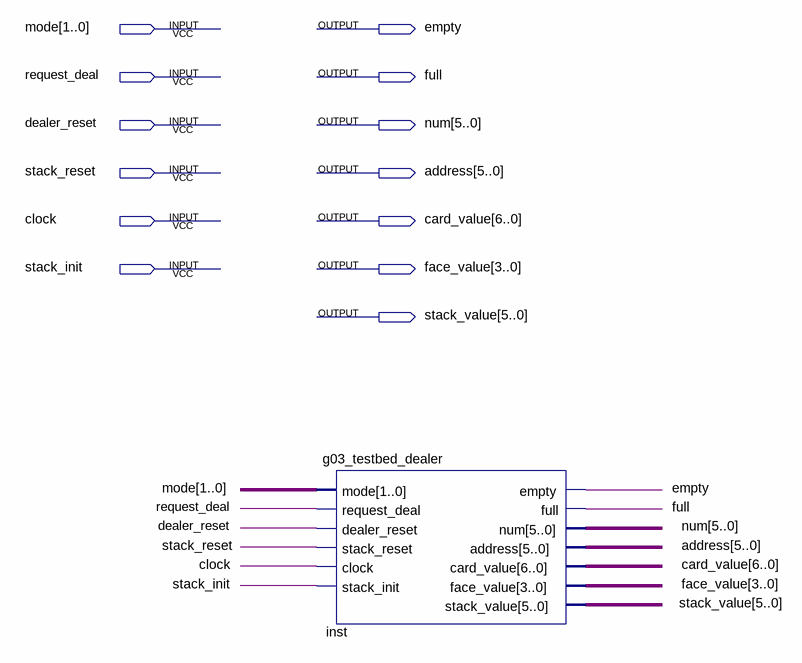
[diagram p0: schematic sheet]
// Quartus schematic g03_lab4.bdf as structural Verilog: 1 symbols, 13 pins
module g03_lab4 (
  input  [1:0] mode,
  input  request_deal,
  input  dealer_reset,
  input  stack_reset,
  input  clock,
  input  stack_init,
  output empty,
  output full,
  output [5:0] num,
  output [5:0] address,
  output [6:0] card_value,
  output [3:0] face_value,
  output [5:0] stack_value
);

  g03_testbed_dealer inst (
    .mode(mode), .request_deal(request_deal), .dealer_reset(dealer_reset), .stack_reset(stack_reset),
    .clock(clock), .stack_init(stack_init), .empty(empty), .full(full), .num(num), .address(address),
    .card_value(card_value), .face_value(face_value), .stack_value(stack_value));
endmodule
